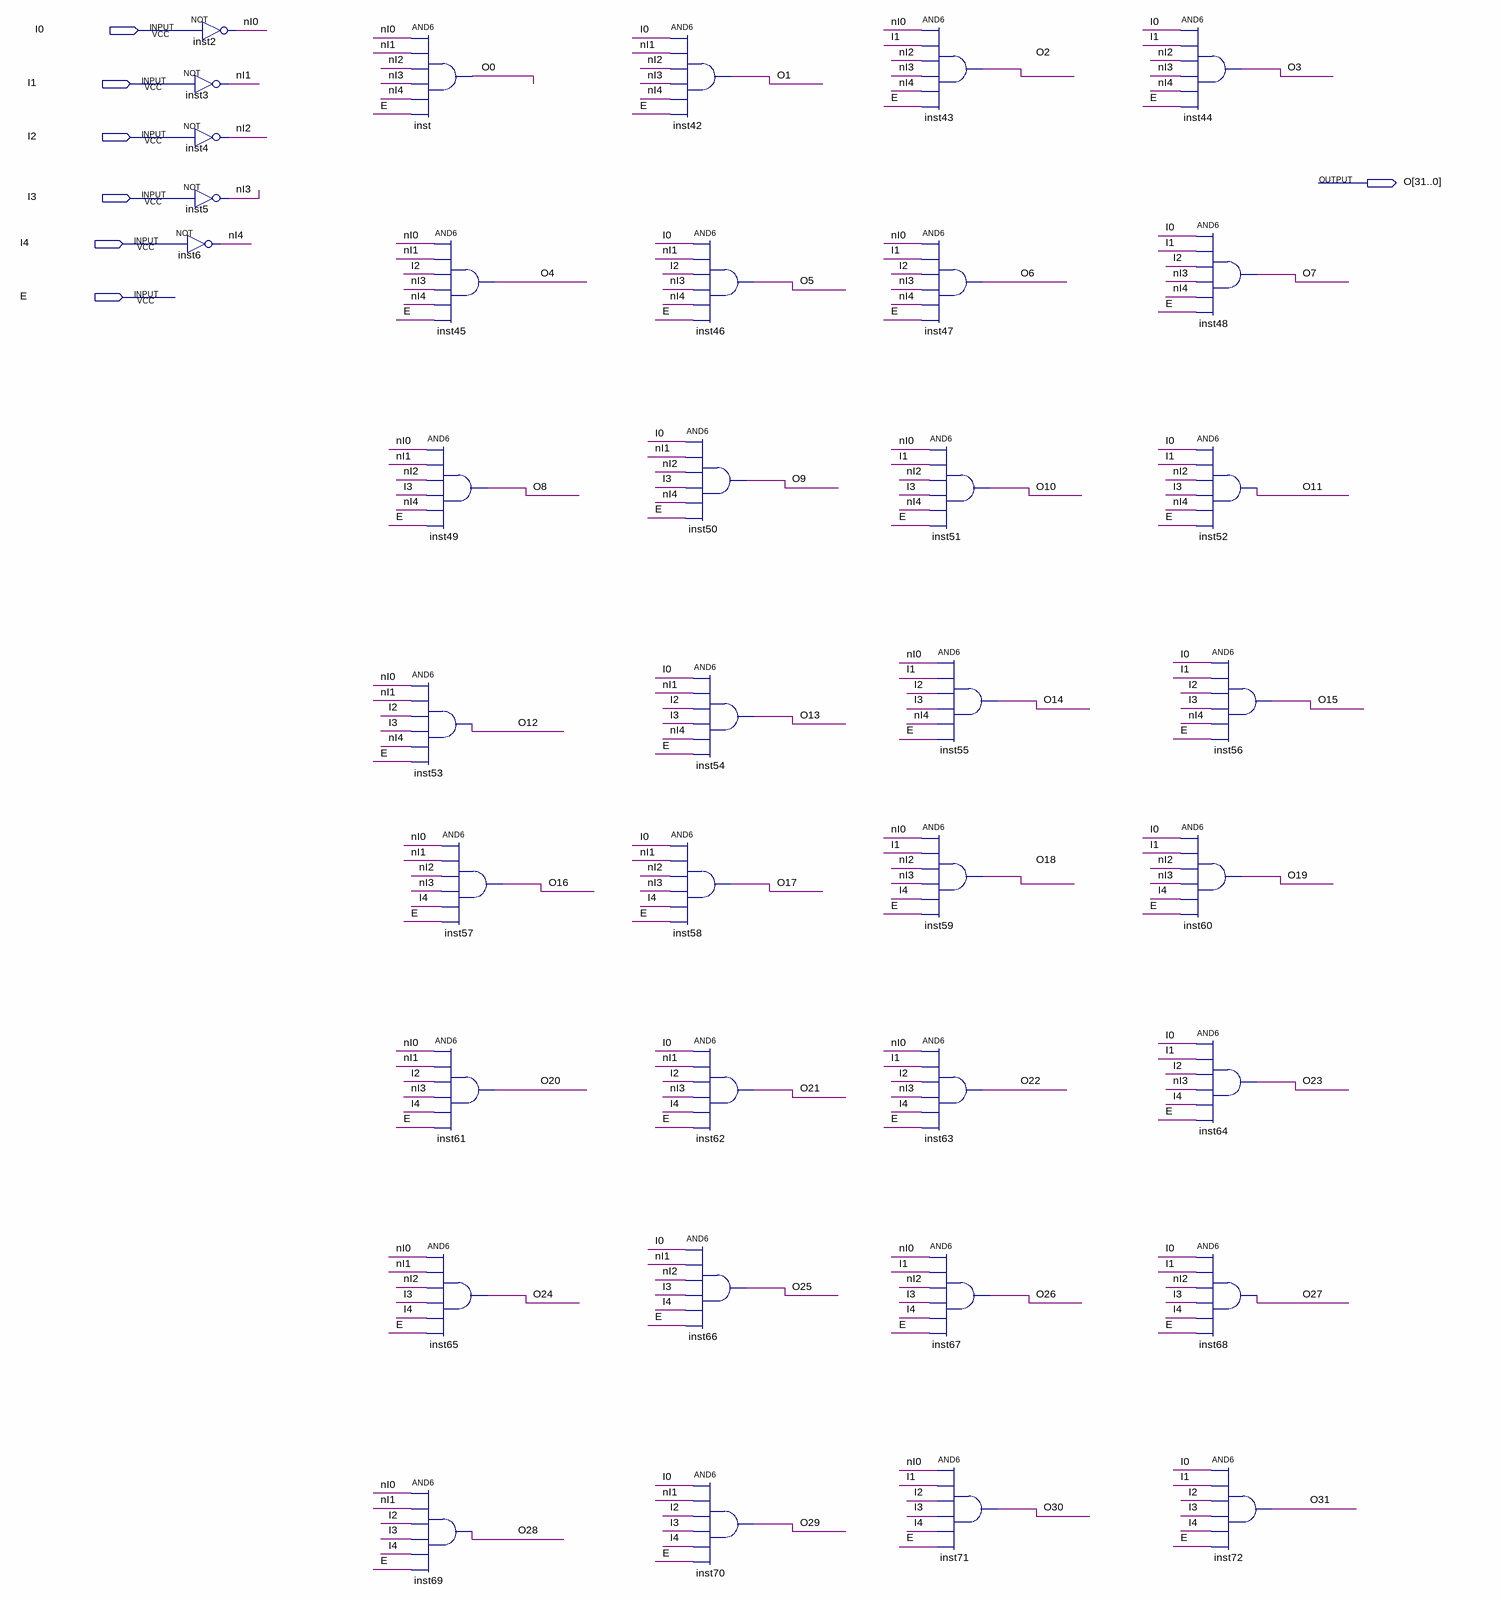
[diagram p0: schematic sheet]
// Quartus schematic DC5_32.bdf as structural Verilog: 37 symbols, 7 pins
module DC5_32 (
  input  I0,
  input  I1,
  input  I2,
  input  I3,
  input  I4,
  input  E,
  output [31:0] O
);

  wire nI0, nI1, nI2, nI3, nI4;

  not inst2 (nI0, I0);
  not inst3 (nI1, I1);
  not inst4 (nI2, I2);
  not inst5 (nI3, I3);
  not inst6 (nI4, I4);
  and inst (O[0], nI0, nI1, nI2, nI3, nI4, E);
  and inst45 (O[4], nI0, nI1, I2, nI3, nI4, E);
  and inst49 (O[8], nI0, nI1, nI2, I3, nI4, E);
  and inst53 (O[12], nI0, nI1, I2, I3, nI4, E);
  and inst57 (O[16], nI0, nI1, nI2, nI3, I4, E);
  and inst61 (O[20], nI0, nI1, I2, nI3, I4, E);
  and inst65 (O[24], nI0, nI1, nI2, I3, I4, E);
  and inst69 (O[28], nI0, nI1, I2, I3, I4, E);
  and inst42 (O[1], I0, nI1, nI2, nI3, nI4, E);
  and inst46 (O[5], I0, nI1, I2, nI3, nI4, E);
  and inst50 (O[9], I0, nI1, nI2, I3, nI4, E);
  and inst54 (O[13], I0, nI1, I2, I3, nI4, E);
  and inst58 (O[17], I0, nI1, nI2, nI3, I4, E);
  and inst62 (O[21], I0, nI1, I2, nI3, I4, E);
  and inst66 (O[25], I0, nI1, nI2, I3, I4, E);
  and inst70 (O[29], I0, nI1, I2, I3, I4, E);
  and inst43 (O[2], nI0, I1, nI2, nI3, nI4, E);
  and inst47 (O[6], nI0, I1, I2, nI3, nI4, E);
  and inst51 (O[10], nI0, I1, nI2, I3, nI4, E);
  and inst55 (O[14], nI0, I1, I2, I3, nI4, E);
  and inst59 (O[18], nI0, I1, nI2, nI3, I4, E);
  and inst63 (O[22], nI0, I1, I2, nI3, I4, E);
  and inst67 (O[26], nI0, I1, nI2, I3, I4, E);
  and inst71 (O[30], nI0, I1, I2, I3, I4, E);
  and inst44 (O[3], I0, I1, nI2, nI3, nI4, E);
  and inst60 (O[19], I0, I1, nI2, nI3, I4, E);
  and inst48 (O[7], I0, I1, I2, nI3, nI4, E);
  and inst52 (O[11], I0, I1, nI2, I3, nI4, E);
  and inst56 (O[15], I0, I1, I2, I3, nI4, E);
  and inst64 (O[23], I0, I1, I2, nI3, I4, E);
  and inst68 (O[27], I0, I1, nI2, I3, I4, E);
  and inst72 (O[31], I0, I1, I2, I3, I4, E);
endmodule
